# EasyEDA schematic THT Dual GNSS + IMU + GSM Rooftop Unit for AgOpenGPS QtOpenGuidance_2020-12-27_08-32-21.json
TITLE: Ri-Shield for AgOpenGPS: Raspberry, Interfaces, Sensors; REV: 1.0; Date: 2020-10-15; Sheet: 1/1; Drawn By: GoRoNb; Company: agopengps.discourse.group
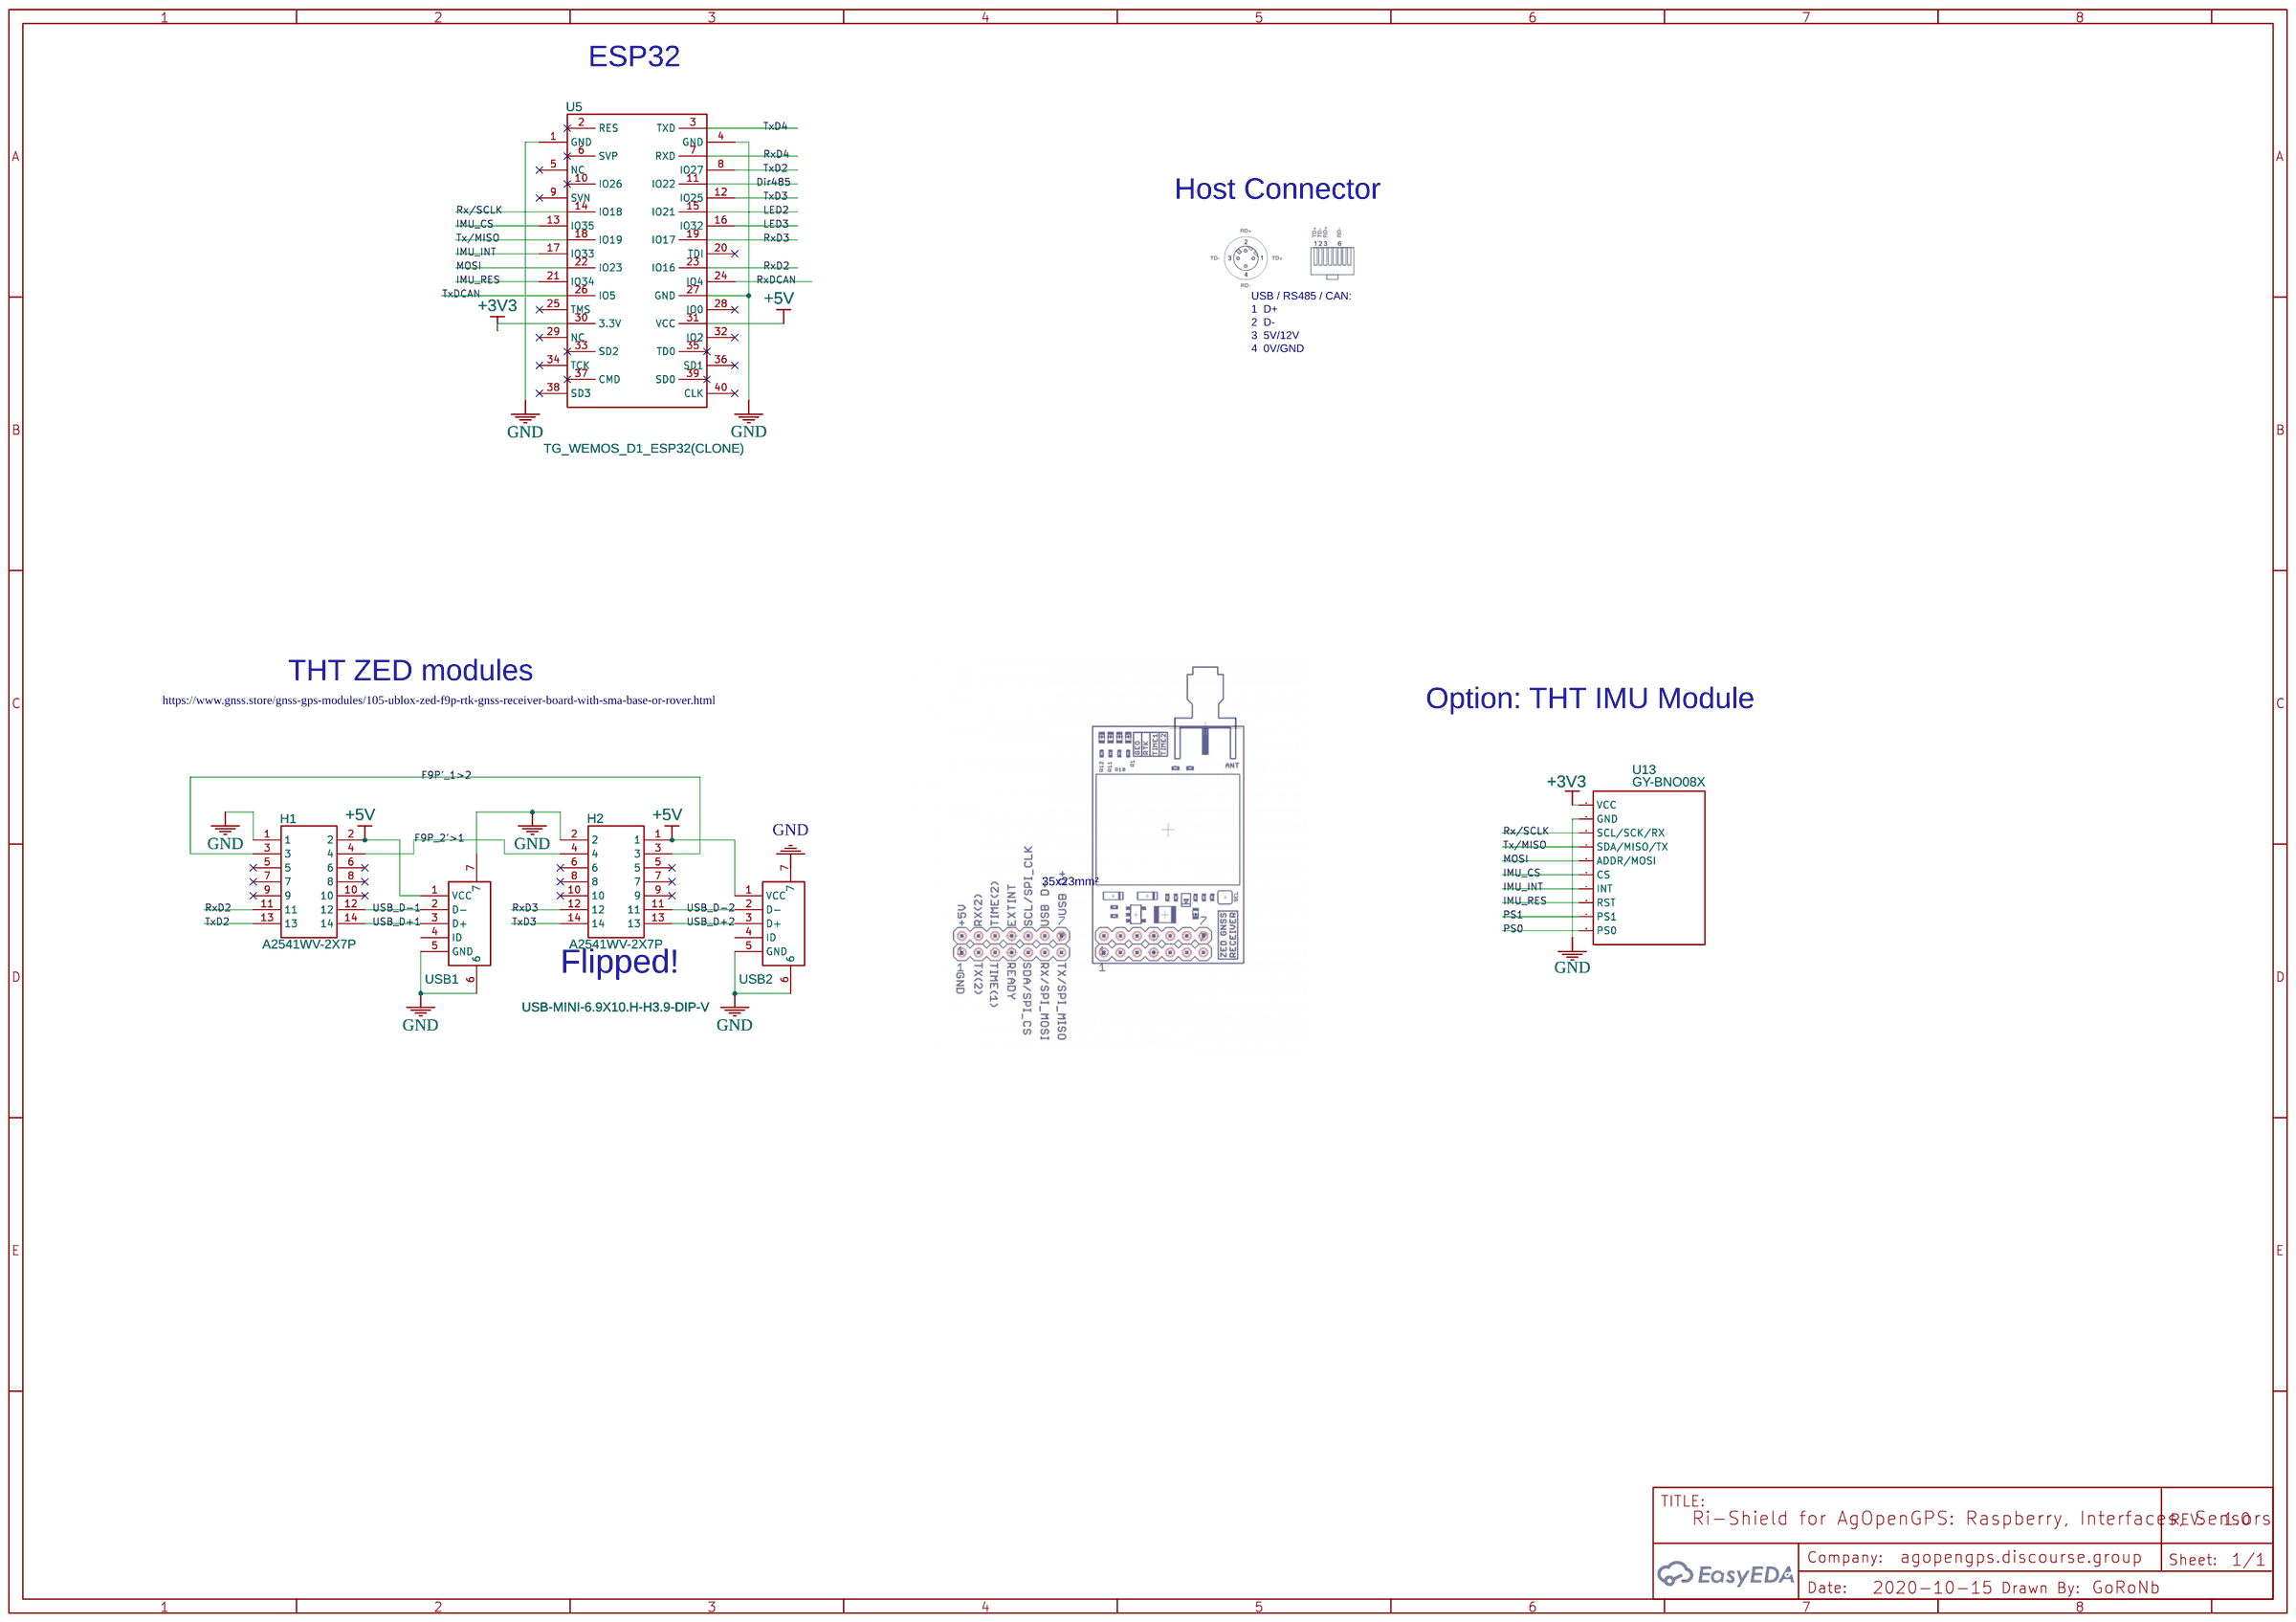
[diagram p0: schematic sheet]

## Parts
H1  A2541WV-2X7P  [HDR-TH_14P-P2.54-V-R2-C7-S2.54_A2541WV-2X7P]
H2  A2541WV-2X7P  [HDR-TH_14P-P2.54-V-R2-C7-S2.54_A2541WV-2X7P]
U5  TG_WEMOS_D1_ESP32(CLONE)  [WEMOS-D1 ESP32]
U13  GY-BNO08X  [GY-BNO08X]
USB1  USB-MINI-6.9X10.H-H3.9-DIP-V  [MINI-USB-TH_C13453]
USB2  USB-MINI-6.9X10.H-H3.9-DIP-V  [MINI-USB-TH_C13453]

## Library data of the parts
H1 H2 = A2541WV-2X7P: Supplier: LCSC; Supplier Part: C225522; Manufacturer: Changjiang Connectors; Manufacturer Part: A2541WV-2x7P; Contributor: LCSC
U5 = TG_WEMOS_D1_ESP32(CLONE): Manufacturer Part: New SchematicLib; Contributor: John Archbold; Supplier Part: undefined
U13 = GY-BNO08X: Contributor: t107408038
USB1 USB2 = USB-MINI-6.9X10.H-H3.9-DIP-V: Supplier: LCSC; Supplier Part: C13453; Manufacturer: LCSC; Contributor: LCSC

## Nets
+3V3: U5.30(3.3V) U13.1(VCC)
+5V: H1.2 H2.1 U5.31(VCC) USB1.1(VCC) USB2.1(VCC)
GND: H1.1 H2.2 U5.1(GND) U5.4(GND) U5.27(GND) U13.2(GND) USB1.5(GND) USB1.6 USB1.7 USB2.5(GND) USB2.6 USB2.7
Dir485: U5.11(IO22)
F9P'_1>2: H1.3 H2.3
F9P_2'>1: H1.4 H2.4
IMU_CS: U5.13(IO35) U13.6(CS)
IMU_INT: U5.17(IO33) U13.7(INT)
IMU_RES: U5.21(IO34) U13.8(RST)
LED2: U5.15(IO21)
LED3: U5.16(IO32)
MOSI: U5.22(IO23) U13.5(ADDR/MOSI)
PS0: U13.10(PS0)
PS1: U13.9(PS1)
Rx/SCLK: U5.14(IO18) U13.3(SCL/SCK/RX)
RxD2: H1.11 U5.23(IO16)
RxD3: H2.12 U5.19(IO17)
RxD4: U5.7(RXD)
RxDCAN: U5.24(IO4)
Tx/MISO: U5.18(IO19) U13.4(SDA/MISO/TX)
TxD2: H1.13 U5.8(IO27)
TxD3: H2.14 U5.12(IO25)
TxD4: U5.3(TXD)
TxDCAN: U5.26(IO5)
USB_D+1: H1.14 USB1.3(D+)
USB_D+2: H2.13 USB2.3(D+)
USB_D-1: H1.12 USB1.2(D-)
USB_D-2: H2.11 USB2.2(D-)

Not connected (* = marked no-connect by the designer): H1 5* 6* 7* 8* 9* 10*; H2 5* 6* 7* 8* 9* 10*; U5 2(RES)* 5(NC)* 6(SVP)* 9(SVN)* 10(IO26)* 20(TDI)* 25(TMS)* 28(IO0)* 29(NC)* 32(IO2)* 33(SD2)* 34(TCK)* 35(TD0)* 36(SD1)* 37(CMD)* 38(SD3)* 39(SD0)* 40(CLK)*; USB1 4(ID); USB2 4(ID)

## Notes on the sheet
- ESP32
- Host Connector
- USB / RS485 / CAN:
  1  D+
  2  D-
  3  5V/12V
  4  0V/GND
- THT ZED modules
- Option: THT IMU Module
- https://www.gnss.store/gnss-gps-modules/105-ublox-zed-f9p-rtk-gnss-receiver-board-with-sma-base-or-rover.html
- 35x23mm²
- Flipped!
